# EAGLE design USBPiano (EAGLE 8.3.2)
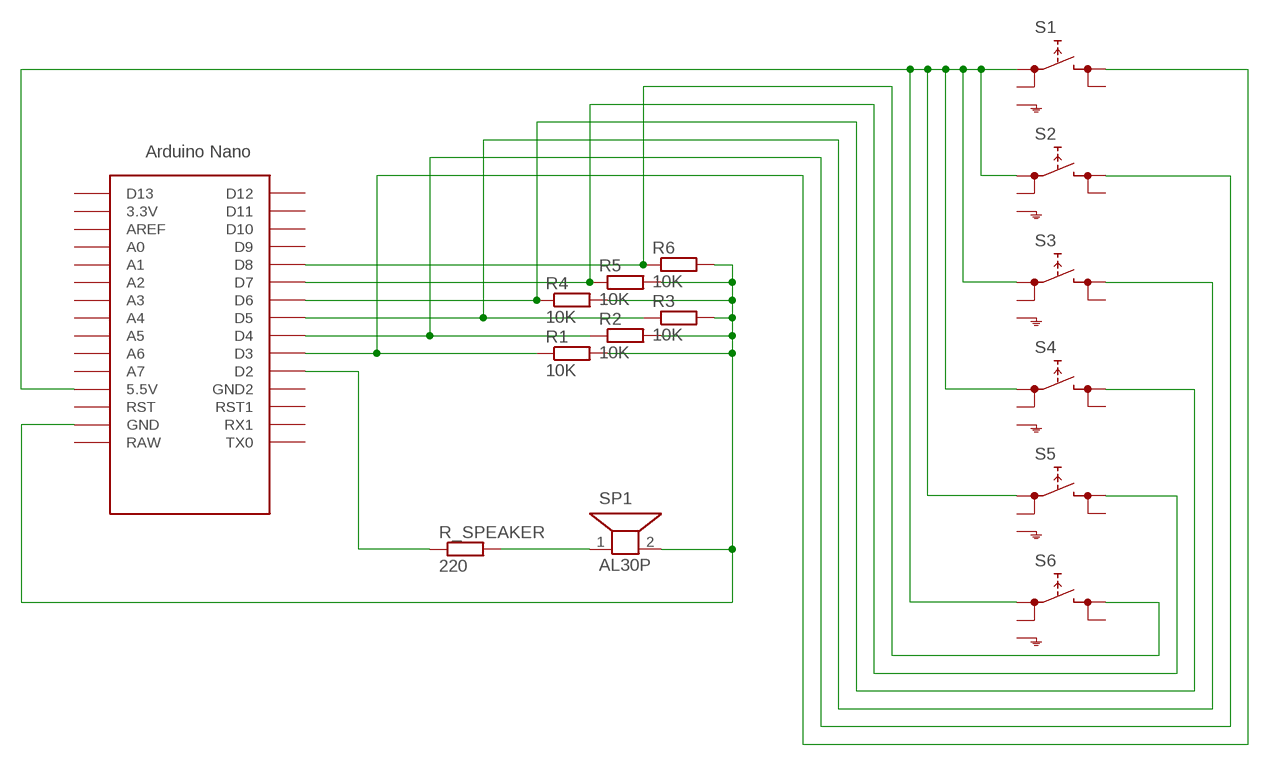
[diagram p0: schematic, sheet 1]

## Parts
R1  10K  R-EU_M0805  [M0805]
R2  10K  R-EU_M0805  [M0805]
R3  10K  R-EU_M0805  [M0805]
R4  10K  R-EU_M0805  [M0805]
R5  10K  R-EU_M0805  [M0805]
R6  10K  R-EU_M0805  [M0805]
R_SPEAKER  220  R-EU_M0805  [M0805]
S1  SKHMPSE010  [SKHMPXE010]
S2  SKHMPSE010  [SKHMPXE010]
S3  SKHMPSE010  [SKHMPXE010]
S4  SKHMPSE010  [SKHMPXE010]
S5  SKHMPSE010  [SKHMPXE010]
S6  SKHMPSE010  [SKHMPXE010]
SP1  AL30P  [AL30P]
U$1  NANO  [NANO]

## Nets
GND: R1.2 R2.2 R3.2 R4.2 R5.2 R6.2 SP1.2 U$1.GND
R_SPEAKER: R_SPEAKER.1 U$1.D2
SPEAKER: R_SPEAKER.2 SP1.1
SWITCH_1: R1.1 S1.3(2.1) U$1.D3
SWITCH_2: R2.1 S2.3(2.1) U$1.D4
SWITCH_3: R3.1 S3.3(2.1) U$1.D5
SWITCH_4: R4.1 S4.3(2.1) U$1.D6
SWITCH_5: R5.1 S5.3(2.1) U$1.D7
SWITCH_6: R6.1 S6.3(2.1) U$1.D8
VCC: S1.1(1.1) S2.1(1.1) S3.1(1.1) S4.1(1.1) S5.1(1.1) S6.1(1.1) U$1.5V(5.5V)
Unconnected: S1.2(1.2) S1.4(2.2) S1.5(SH) S2.2(1.2) S2.4(2.2) S2.5(SH) S3.2(1.2) S3.4(2.2) S3.5(SH) S4.2(1.2) S4.4(2.2) S4.5(SH) S5.2(1.2) S5.4(2.2) S5.5(SH) S6.2(1.2) S6.4(2.2) S6.5(SH) U$1.3.3V U$1.A0 U$1.A1 U$1.A2 U$1.A3 U$1.A4 U$1.A5 U$1.A6 U$1.A7 U$1.AREF U$1.D9 U$1.D10 U$1.D11 U$1.D12 U$1.D13 U$1.GND1(GND2) U$1.ICSP1 U$1.ICSP2 U$1.ICSP3 U$1.ICSP4 U$1.ICSP5 U$1.ICSP6 U$1.RAW U$1.RST U$1.RST1 U$1.RX1 U$1.TX0

## Library data of the parts
R1-R6 R_SPEAKER = resistor:R-EU_: RESISTOR, European symbol
S1-S6 = switch:SKHMP*E010: 6.2 X 6.5mm TACT Switch (SMD) Source: http://www3.alps.co.jp/WebObjects/catalog.woa/PDF/E/Switch/Tact/SKHM/SKHM.PDF
SP1 = buzzer:AL30P: SPEAKER Source: Buerklin; OC_FARNELL: unknown; OC_NEWARK: unknown
U$1 = Arduino-clone:NANO: Arduino Nano

## Board
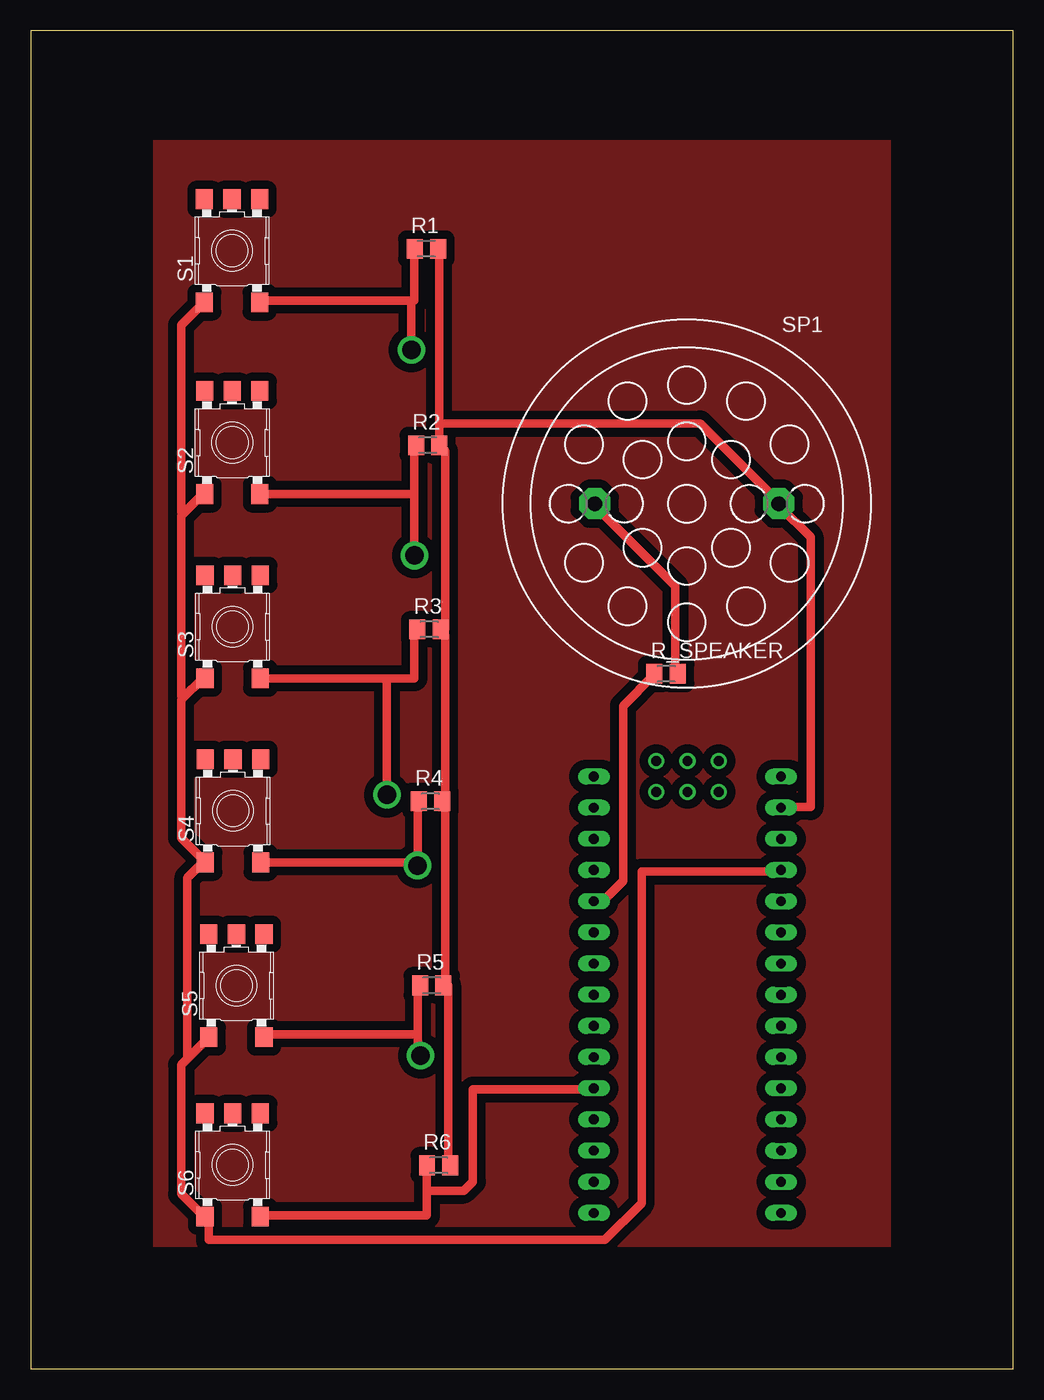
[diagram p1: board, top side]
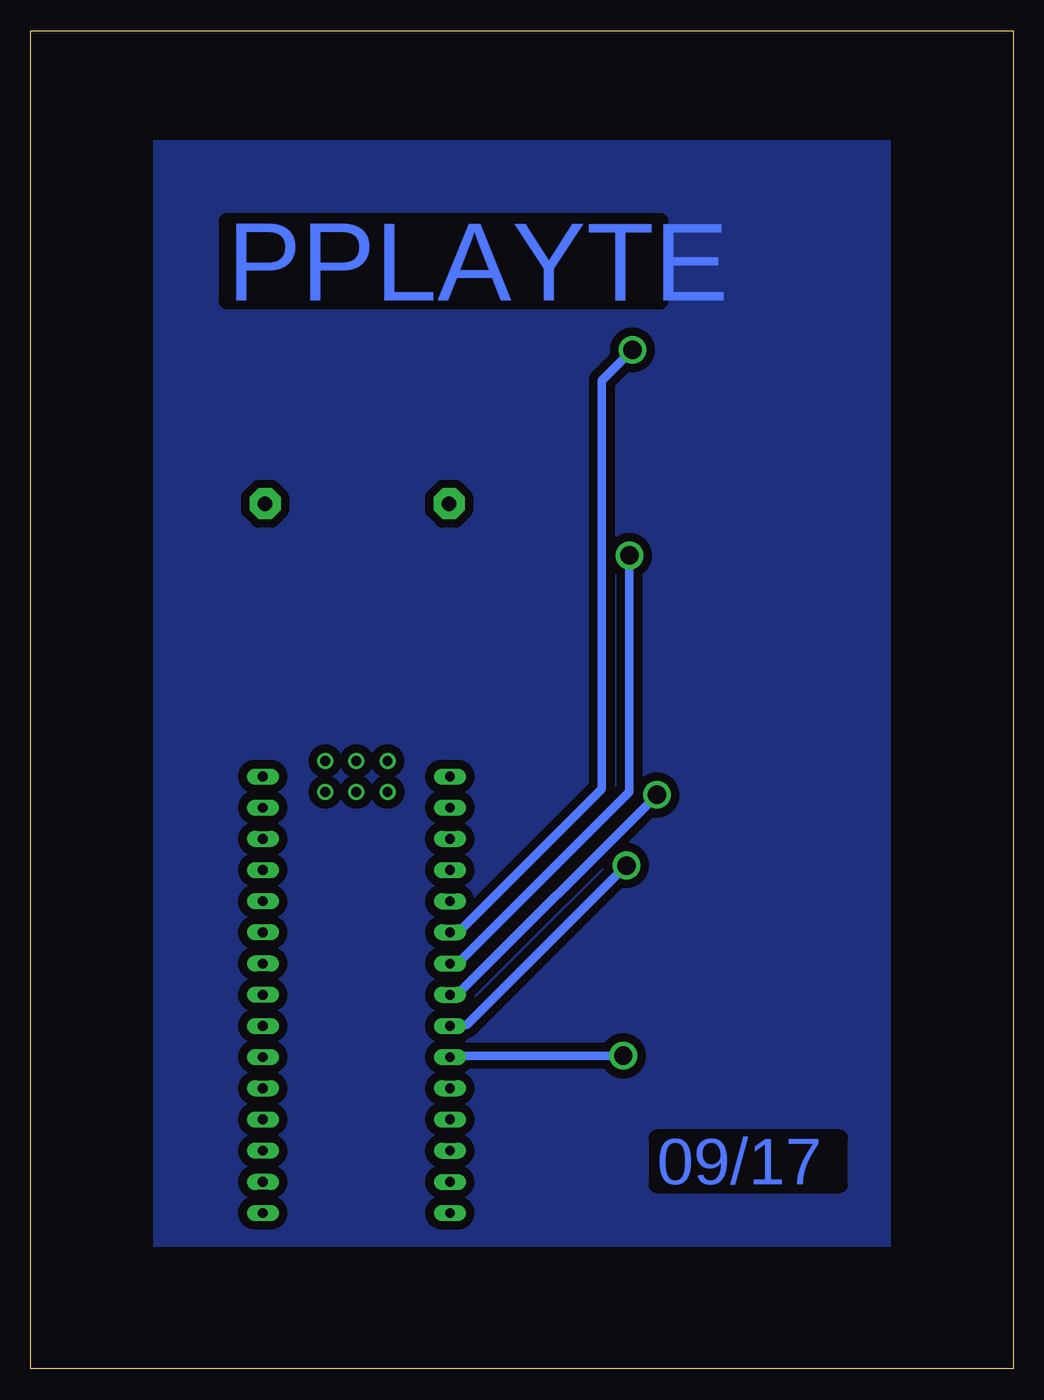
[diagram p2: board, bottom side, seen from below]

Size 80 x 109 mm. Coordinates in mm from the lower left corner, seen from the top.
Outline: 0,0 80,0 80,109 0,109 0,0
Copper layers (1*16): Top 0.035mm / dielectric 1.5mm / Bottom 0.035mm
Design rules "default *": minimum track width 0.7mm, minimum drill 1.5mm, track to track 0.7mm, track to pad 0.7mm, pad to pad 0.7mm, via to via 0.7mm, smd to smd 0.7mm, copper to edge 40mil, drill to drill 6mil, minimum pad ring 10mil, minimum via ring 8mil, stop-mask expansion 4mil, vias tented up to drill 0mil, thermal gap 10mil

### Footprints (pad centres in the part's own frame; a part is rotated, then mirrored left to right if it is on the bottom)
M0805 = smd 1.3 x 1.6: 1 -0.95,0; 2 0.95,0
SKHMPXE010 = smd 1.6 x 1.4: 1 -4.2,2.25; 2 4.2,2.25; 3 -4.2,-2.25; 4 4.2,-2.25; 5 4.2,0
AL30P = drill 1.194 pad 2.54 octagon: 1 -7.493,0; 2 7.493,0
NANO = drill 0.8 long: 3.3V -10.16,24.13; 5V -10.16,-1.27; A0 -10.16,19.05; A1 -10.16,16.51; A2 -10.16,13.97; A3 -10.16,11.43; A4 -10.16,8.89; A5 -10.16,6.35; A6 -10.16,3.81; A7 -10.16,1.27; AREF -10.16,21.59; D2 5.08,1.27; D3 5.08,3.81; D4 5.08,6.35; D5 5.08,8.89; D6 5.08,11.43; D7 5.08,13.97; D8 5.08,16.51; D9 5.08,19.05; D10 5.08,21.59; D11 5.08,24.13; D12 5.08,26.67; D13 -10.16,26.67; GND -10.16,-6.35; GND1 5.08,-1.27; RAW -10.16,-8.89; RST -10.16,-3.81; RST1 5.08,-3.81; RX1 5.08,-6.35; TX0 5.08,-8.89 | drill 0.8: ICSP1 -5.08,-10.16; ICSP2 -5.08,-7.62; ICSP3 -2.54,-10.16; ICSP4 -2.54,-7.62; ICSP5 0,-10.16; ICSP6 0,-7.62

### Placement (x,y rotation side)
R1  32.22,91.23 0 top
R2  32.33,75.23 0 top
R3  32.44,60.23 0 top
R4  32.55,46.23 0 top
R5  32.66,31.23 0 top
R6  33.22,16.58 0 top
R_SPEAKER  51.74,56.61 0 top
S1  16.39,91.08 90 top
S2  16.41,75.45 90 top
S3  16.44,60.45 90 top
S4  16.47,45.45 90 top
S5  16.75,31.21 90 top
S6  16.44,16.61 90 top
SP1  53.42,70.47 0 top
U$1  50.94,39.36 180 top

### Tracks (layer width: path | path; a pad name or v marks a point on that pad's centre or on a via)
GND
  Top 0.7: U$1.GND 61.25,45.75 63.5,45.75 63.5,67.75 61,70.25 SP1.2 60.75,70.75 54.5,77 33.25,77 | 33.25,77 33.25,75.5 R2.2 33.5,75 33.75,74.75 33.75,60.25 R3.2 33.5,60 33.75,59.75 33.75,46.25 R4.2 33.5,46 33.75,45.75 33.75,31.25 R5.2 34,31.25 34,16.75 R6.2 | 33.25,77 33.25,91 R1.2
N$1
  pour Bottom: 10,100 70,100 70,10 60,10 10,10
N$2
  pour Top: 10,100 10,10 70,10 70,100
R_SPEAKER
  Top 0.7: R_SPEAKER.1 50.75,56.5 48.25,54 48.25,39.75 46.75,38.25 46,38.25 U$1.D2
SPEAKER
  Top 0.7: R_SPEAKER.2 52.5,56.75 52.5,63.75 46,70.25 SP1.1
SWITCH_1  (via drill 1.5)
  Top 0.7: 31,87 31.25,87 31.25,91 R1.1 | 31,87 18.75,87 S1.3 | 31,87 v31,83
  Bottom 0.7: v31,83 33.5,80.5 33.5,47.25 45,35.75 45.75,35.75 U$1.D3
SWITCH_2  (via drill 1.5)
  Top 0.7: 31.25,71.25 S2.3 | 31.25,71.25 31.25,75 R2.1 | 31.25,71.25 v31.25,66.25
  Bottom 0.7: v31.25,66.25 31.25,47 45,33.25 45.75,33.25 U$1.D4
SWITCH_3  (via drill 1.5)
  Top 0.7: 29,56.25 31.25,56.25 31.25,60 R3.1 | 29,56.25 S3.3 | 29,56.25 v29,46.75
  Bottom 0.7: v29,46.75 45.25,30.5 45.75,30.5 U$1.D5
SWITCH_4  (via drill 1.5)
  Top 0.7: 31.5,41.25 S4.3 | 31.5,41.25 31.5,46 R4.1 | v31.5,41 31.5,41.25
  Bottom 0.7: v31.5,41 44.5,28 45.75,28 U$1.D6
SWITCH_5  (via drill 1.5)
  Top 0.7: 31.5,27.25 19,27.25 S5.3 | 31.5,27.25 31.5,31 R5.1 | v31.75,25.5 31.5,25.75 31.5,27.25
  Bottom 0.7: v31.75,25.5 45.75,25.5 U$1.D7
SWITCH_6
  Top 0.7: 32.25,14.5 32.25,16.5 R6.1 | 32.25,14.5 32.25,12.5 18.75,12.5 S6.3 | 32.25,14.5 35.25,14.5 36,15.25 36,22.75 45.75,22.75 U$1.D8
VCC
  Top 0.7: 12.88,25.38 S5.1 | 12.88,25.38 12.25,24.75 12.25,14.25 14,12.5 S6.1 14.5,12.25 14.5,10.5 46.75,10.5 49.75,13.5 49.75,40.5 61,40.5 U$1.5V | 12.88,25.38 12.75,25.5 12.75,40 14,41.25 S4.1 14,41.5 12.25,43.25 12.25,54.5 12.38,54.62 | 12.38,54.62 14,56.25 S3.1 | 12.38,69.62 12.25,69.5 12.25,54.75 12.38,54.62 | 12.38,69.62 14,71.25 S2.1 | S1.1 14,86.75 12.25,85 12.25,69.75 12.38,69.62

### Text on the board
Bottom: PPLAYTE | 09/17